# EAGLE design max10_bb (EAGLE 7.3.0)
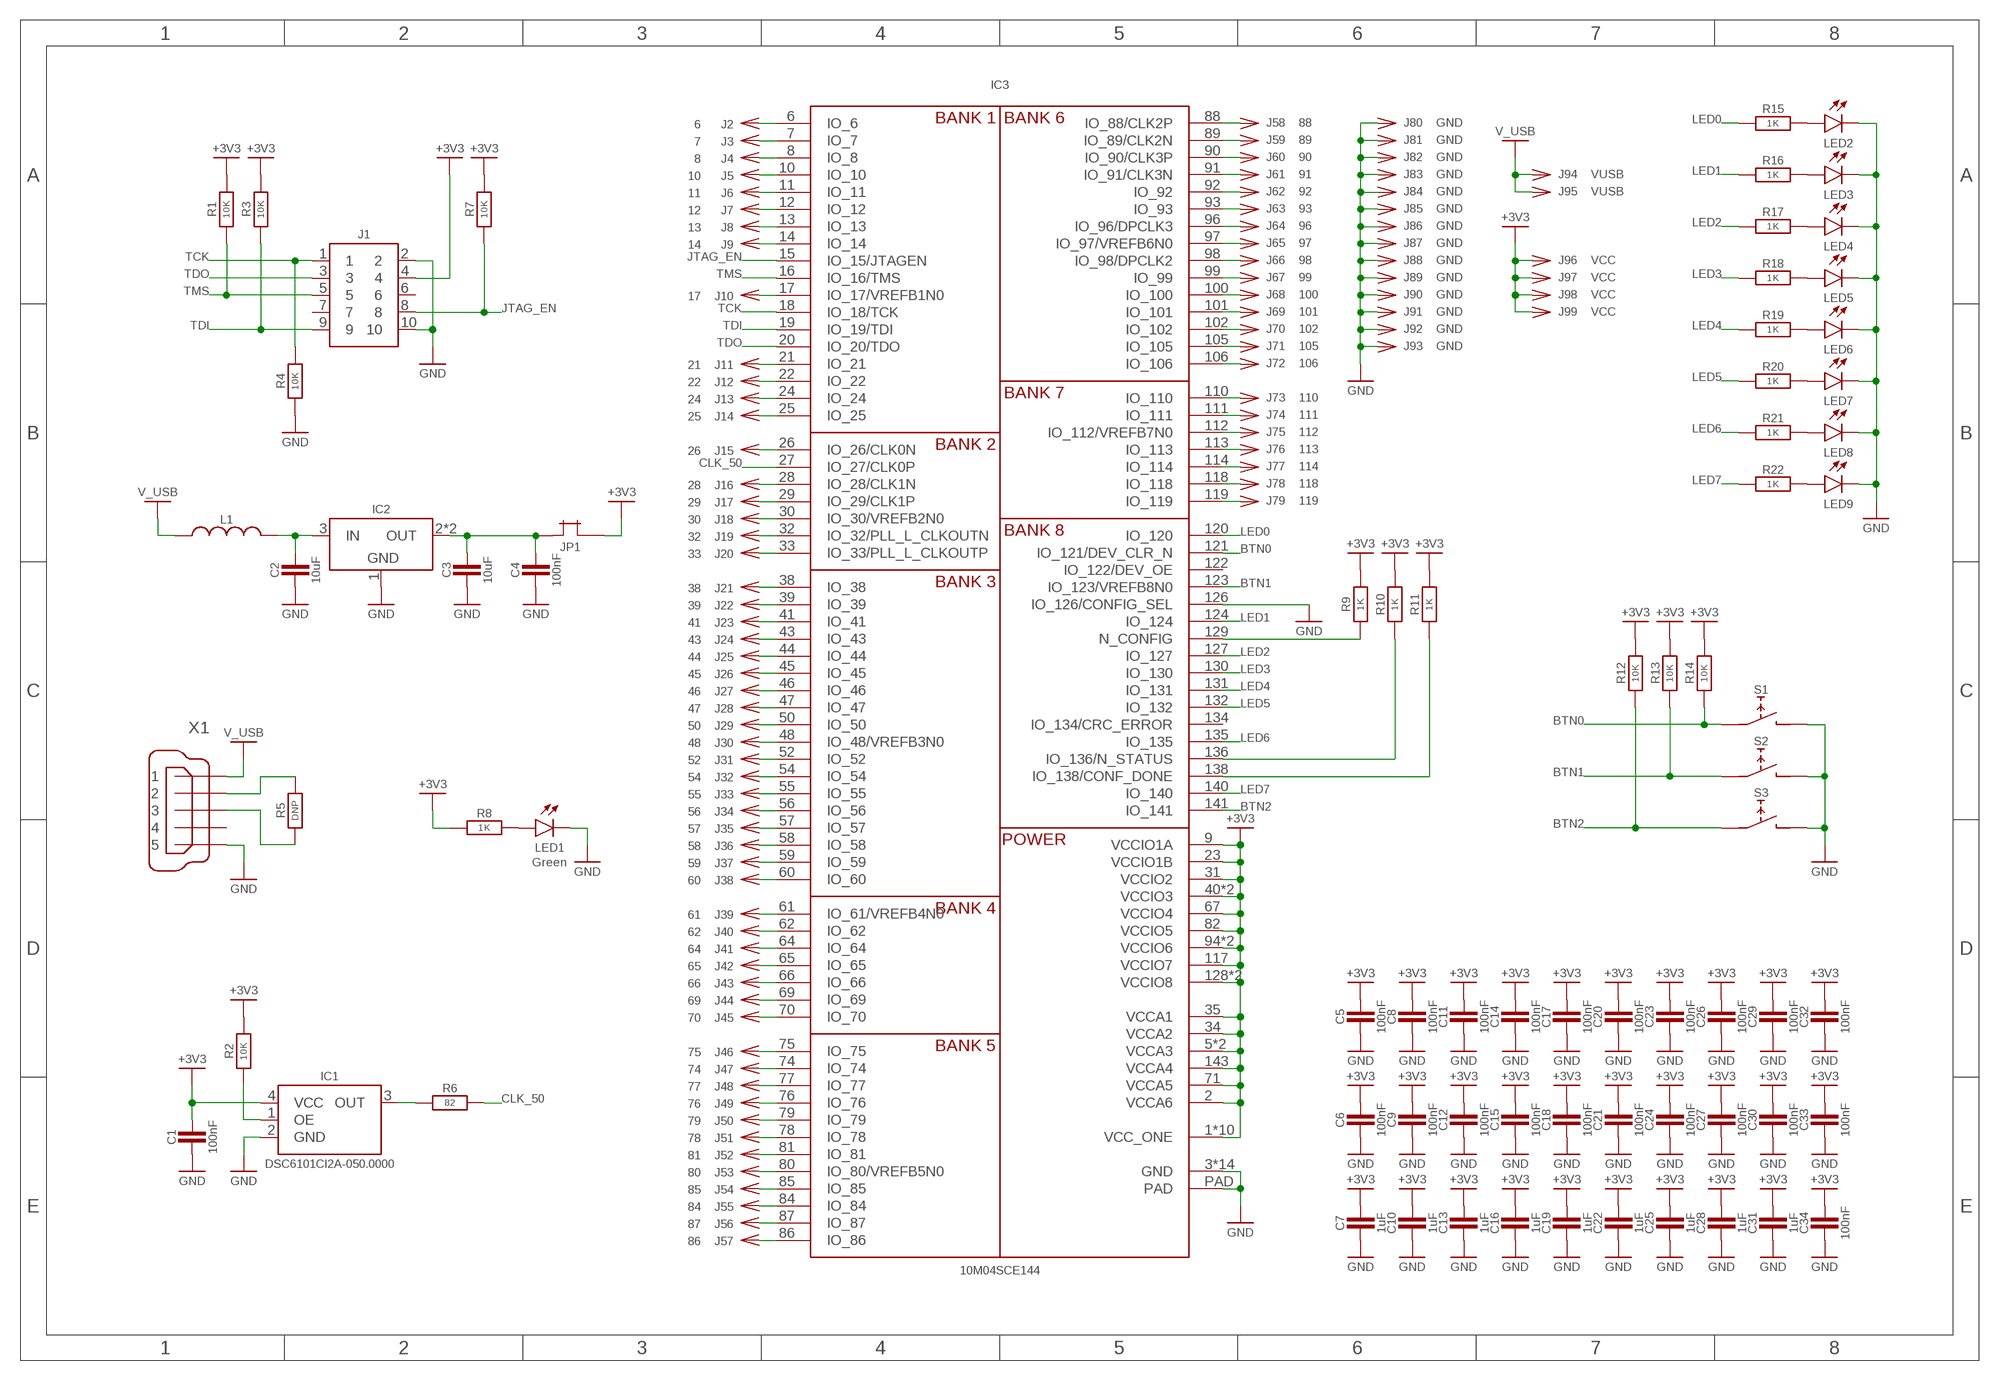
[diagram p0: schematic, sheet 1]

## Parts
C1  100nF  C-0603  [SMD0603]
C2  10uF  C-0805  [SMD0805]
C3  10uF  C-0805  [SMD0805]
C4  100nF  C-0603  [SMD0603]
C5  100nF  C-0603  [SMD0603]
C6  100nF  C-0603  [SMD0603]
C7  1uF  C-0603  [SMD0603]
C8  100nF  C-0603  [SMD0603]
C9  100nF  C-0603  [SMD0603]
C10  1uF  C-0603  [SMD0603]
C11  100nF  C-0603  [SMD0603]
C12  100nF  C-0603  [SMD0603]
C13  1uF  C-0603  [SMD0603]
C14  100nF  C-0603  [SMD0603]
C15  100nF  C-0603  [SMD0603]
C16  1uF  C-0603  [SMD0603]
C17  100nF  C-0603  [SMD0603]
C18  100nF  C-0603  [SMD0603]
C19  1uF  C-0603  [SMD0603]
C20  100nF  C-0603  [SMD0603]
C21  100nF  C-0603  [SMD0603]
C22  1uF  C-0603  [SMD0603]
C23  100nF  C-0603  [SMD0603]
C24  100nF  C-0603  [SMD0603]
C25  1uF  C-0603  [SMD0603]
C26  100nF  C-0603  [SMD0603]
C27  100nF  C-0603  [SMD0603]
C28  1uF  C-0603  [SMD0603]
C29  100nF  C-0603  [SMD0603]
C30  100nF  C-0603  [SMD0603]
C31  1uF  C-0603  [SMD0603]
C32  100nF  C-0603  [SMD0603]
C33  100nF  C-0603  [SMD0603]
C34  100nF  C-0603  [SMD0603]
IC1  DSC6101CI2A-050.0000  OSC_EN-CDFN4  [CDFN4]
IC2  LM1117-SOT223  [SOT223]
IC3  10M04SCE144  [EQFP-144-0.5MM]
J1  HEADER-5X2-TH-2.54  [HEADER-5X2-2.54MM]
J2  6  CONN-SINGLE-TH  [PIN-TH]
J3  7  CONN-SINGLE-TH  [PIN-TH]
J4  8  CONN-SINGLE-TH  [PIN-TH]
J5  10  CONN-SINGLE-TH  [PIN-TH]
J6  11  CONN-SINGLE-TH  [PIN-TH]
J7  12  CONN-SINGLE-TH  [PIN-TH]
J8  13  CONN-SINGLE-TH  [PIN-TH]
J9  14  CONN-SINGLE-TH  [PIN-TH]
J10  17  CONN-SINGLE-TH  [PIN-TH]
J11  21  CONN-SINGLE-TH  [PIN-TH]
J12  22  CONN-SINGLE-TH  [PIN-TH]
J13  24  CONN-SINGLE-TH  [PIN-TH]
J14  25  CONN-SINGLE-TH  [PIN-TH]
J15  26  CONN-SINGLE-TH  [PIN-TH]
J16  28  CONN-SINGLE-TH  [PIN-TH]
J17  29  CONN-SINGLE-TH  [PIN-TH]
J18  30  CONN-SINGLE-TH  [PIN-TH]
J19  32  CONN-SINGLE-TH  [PIN-TH]
J20  33  CONN-SINGLE-TH  [PIN-TH]
J21  38  CONN-SINGLE-TH  [PIN-TH]
J22  39  CONN-SINGLE-TH  [PIN-TH]
J23  41  CONN-SINGLE-TH  [PIN-TH]
J24  43  CONN-SINGLE-TH  [PIN-TH]
J25  44  CONN-SINGLE-TH  [PIN-TH]
J26  45  CONN-SINGLE-TH  [PIN-TH]
J27  46  CONN-SINGLE-TH  [PIN-TH]
J28  47  CONN-SINGLE-TH  [PIN-TH]
J29  50  CONN-SINGLE-TH  [PIN-TH]
J30  48  CONN-SINGLE-TH  [PIN-TH]
J31  52  CONN-SINGLE-TH  [PIN-TH]
J32  54  CONN-SINGLE-TH  [PIN-TH]
J33  55  CONN-SINGLE-TH  [PIN-TH]
J34  56  CONN-SINGLE-TH  [PIN-TH]
J35  57  CONN-SINGLE-TH  [PIN-TH]
J36  58  CONN-SINGLE-TH  [PIN-TH]
J37  59  CONN-SINGLE-TH  [PIN-TH]
J38  60  CONN-SINGLE-TH  [PIN-TH]
J39  61  CONN-SINGLE-TH  [PIN-TH]
J40  62  CONN-SINGLE-TH  [PIN-TH]
J41  64  CONN-SINGLE-TH  [PIN-TH]
J42  65  CONN-SINGLE-TH  [PIN-TH]
J43  66  CONN-SINGLE-TH  [PIN-TH]
J44  69  CONN-SINGLE-TH  [PIN-TH]
J45  70  CONN-SINGLE-TH  [PIN-TH]
J46  75  CONN-SINGLE-TH  [PIN-TH]
J47  74  CONN-SINGLE-TH  [PIN-TH]
J48  77  CONN-SINGLE-TH  [PIN-TH]
J49  76  CONN-SINGLE-TH  [PIN-TH]
J50  79  CONN-SINGLE-TH  [PIN-TH]
J51  78  CONN-SINGLE-TH  [PIN-TH]
J52  81  CONN-SINGLE-TH  [PIN-TH]
J53  80  CONN-SINGLE-TH  [PIN-TH]
J54  85  CONN-SINGLE-TH  [PIN-TH]
J55  84  CONN-SINGLE-TH  [PIN-TH]
J56  87  CONN-SINGLE-TH  [PIN-TH]
J57  86  CONN-SINGLE-TH  [PIN-TH]
J58  88  CONN-SINGLE-TH  [PIN-TH]
J59  89  CONN-SINGLE-TH  [PIN-TH]
J60  90  CONN-SINGLE-TH  [PIN-TH]
J61  91  CONN-SINGLE-TH  [PIN-TH]
J62  92  CONN-SINGLE-TH  [PIN-TH]
J63  93  CONN-SINGLE-TH  [PIN-TH]
J64  96  CONN-SINGLE-TH  [PIN-TH]
J65  97  CONN-SINGLE-TH  [PIN-TH]
J66  98  CONN-SINGLE-TH  [PIN-TH]
J67  99  CONN-SINGLE-TH  [PIN-TH]
J68  100  CONN-SINGLE-TH  [PIN-TH]
J69  101  CONN-SINGLE-TH  [PIN-TH]
J70  102  CONN-SINGLE-TH  [PIN-TH]
J71  105  CONN-SINGLE-TH  [PIN-TH]
J72  106  CONN-SINGLE-TH  [PIN-TH]
J73  110  CONN-SINGLE-TH  [PIN-TH]
J74  111  CONN-SINGLE-TH  [PIN-TH]
J75  112  CONN-SINGLE-TH  [PIN-TH]
J76  113  CONN-SINGLE-TH  [PIN-TH]
J77  114  CONN-SINGLE-TH  [PIN-TH]
J78  118  CONN-SINGLE-TH  [PIN-TH]
J79  119  CONN-SINGLE-TH  [PIN-TH]
J80  GND  CONN-SINGLE-TH  [PIN-TH]
J81  GND  CONN-SINGLE-TH  [PIN-TH]
J82  GND  CONN-SINGLE-TH  [PIN-TH]
J83  GND  CONN-SINGLE-TH  [PIN-TH]
J84  GND  CONN-SINGLE-TH  [PIN-TH]
J85  GND  CONN-SINGLE-TH  [PIN-TH]
J86  GND  CONN-SINGLE-TH  [PIN-TH]
J87  GND  CONN-SINGLE-TH  [PIN-TH]
J88  GND  CONN-SINGLE-TH  [PIN-TH]
J89  GND  CONN-SINGLE-TH  [PIN-TH]
J90  GND  CONN-SINGLE-TH  [PIN-TH]
J91  GND  CONN-SINGLE-TH  [PIN-TH]
J92  GND  CONN-SINGLE-TH  [PIN-TH]
J93  GND  CONN-SINGLE-TH  [PIN-TH]
J94  VUSB  CONN-SINGLE-TH  [PIN-TH]
J95  VUSB  CONN-SINGLE-TH  [PIN-TH]
J96  VCC  CONN-SINGLE-TH  [PIN-TH]
J97  VCC  CONN-SINGLE-TH  [PIN-TH]
J98  VCC  CONN-SINGLE-TH  [PIN-TH]
J99  VCC  CONN-SINGLE-TH  [PIN-TH]
JP1  JUMPER-TH-TH  [JUMPER-TH]
L1  L-0603  [SMD0603]
LED1  Green  LED_SMDLED_0603  [SMD0603]
LED2  LED_SMDLED_0603  [SMD0603]
LED3  LED_SMDLED_0603  [SMD0603]
LED4  LED_SMDLED_0603  [SMD0603]
LED5  LED_SMDLED_0603  [SMD0603]
LED6  LED_SMDLED_0603  [SMD0603]
LED7  LED_SMDLED_0603  [SMD0603]
LED8  LED_SMDLED_0603  [SMD0603]
LED9  LED_SMDLED_0603  [SMD0603]
R1  10K  R-0603  [SMD0603]
R2  10K  R-0603  [SMD0603]
R3  10K  R-0603  [SMD0603]
R4  10K  R-0603  [SMD0603]
R5  DNP  R-0603  [SMD0603]
R6  82  R-0603  [SMD0603]
R7  10K  R-0603  [SMD0603]
R8  1K  R-0603  [SMD0603]
R9  1K  R-0603  [SMD0603]
R10  1K  R-0603  [SMD0603]
R11  1K  R-0603  [SMD0603]
R12  10K  R-0603  [SMD0603]
R13  10K  R-0603  [SMD0603]
R14  10K  R-0603  [SMD0603]
R15  1K  R-0603  [SMD0603]
R16  1K  R-0603  [SMD0603]
R17  1K  R-0603  [SMD0603]
R18  1K  R-0603  [SMD0603]
R19  1K  R-0603  [SMD0603]
R20  1K  R-0603  [SMD0603]
R21  1K  R-0603  [SMD0603]
R22  1K  R-0603  [SMD0603]
S1  TACT_SWITCH_6MM-SMD  [TACT-SMD-6MM]
S2  TACT_SWITCH_6MM-SMD  [TACT-SMD-6MM]
S3  TACT_SWITCH_6MM-SMD  [TACT-SMD-6MM]
X1  MINI-USB-32005-201  [32005-201]

## Nets
+3V3: C1.2 C5.2 C6.2 C7.2 C8.2 C9.2 C10.2 C11.2 C12.2 C13.2 C14.2 C15.2 C16.2 C17.2 C18.2 C19.2 C20.2 C21.2 C22.2 C23.2 C24.2 C25.2 C26.2 C27.2 C28.2 C29.2 C30.2 C31.2 C32.2 C33.2 C34.2 IC1.4(VCC) IC3.1(VCC_ONE) IC3.2(VCCA6) IC3.5(VCCA3) IC3.9(VCCIO1A) IC3.23(VCCIO1B) IC3.31(VCCIO2) IC3.34(VCCA2) IC3.35(VCCA1) IC3.36(VCC_ONE) IC3.37(VCC_ONE) IC3.40(VCCIO3) IC3.49(VCCIO3) IC3.51(VCC_ONE) IC3.67(VCCIO4) IC3.71(VCCA5) IC3.72(VCC_ONE) IC3.73(VCC_ONE) IC3.82(VCCIO5) IC3.94(VCCIO6) IC3.103(VCCIO6) IC3.107(VCCA3) IC3.108(VCC_ONE) IC3.109(VCC_ONE) IC3.115(VCC_ONE) IC3.117(VCCIO7) IC3.128(VCCIO8) IC3.139(VCCIO8) IC3.143(VCCA4) IC3.144(VCC_ONE) J1.4 J96.1 J97.1 J98.1 J99.1 JP1.2 R1.2 R2.2 R3.2 R7.2 R8.1 R9.2 R10.2 R11.2 R12.2 R13.2 R14.2
BTN0: IC3.121(IO_121/DEV_CLR_N) R14.1 S1.1 S1.2
BTN1: IC3.123(IO_123/VREFB8N0) R13.1 S2.1 S2.2
BTN2: IC3.141(IO_141) R12.1 S3.1 S3.2
CLK_50: IC3.27(IO_27/CLK0P) R6.2
GND: C1.1 C2.1 C3.1 C4.1 C5.1 C6.1 C7.1 C8.1 C9.1 C10.1 C11.1 C12.1 C13.1 C14.1 C15.1 C16.1 C17.1 C18.1 C19.1 C20.1 C21.1 C22.1 C23.1 C24.1 C25.1 C26.1 C27.1 C28.1 C29.1 C30.1 C31.1 C32.1 C33.1 C34.1 IC1.2(GND) IC2.1(GND) IC3.3(GND) IC3.4(GND) IC3.42(GND) IC3.53(GND) IC3.63(GND) IC3.68(GND) IC3.83(GND) IC3.95(GND) IC3.104(GND) IC3.116(GND) IC3.125(GND) IC3.126(IO_126/CONFIG_SEL) IC3.133(GND) IC3.137(GND) IC3.142(GND) IC3.PAD J1.2 J1.10 J80.1 J81.1 J82.1 J83.1 J84.1 J85.1 J86.1 J87.1 J88.1 J89.1 J90.1 J91.1 J92.1 J93.1 LED1.2(C) LED2.2(C) LED3.2(C) LED4.2(C) LED5.2(C) LED6.2(C) LED7.2(C) LED8.2(C) LED9.2(C) R4.1 S1.3 S1.4 S2.3 S2.4 S3.3 S3.4 X1.5
IN: C2.2 IC2.3(IN) L1.2
JTAG_EN: IC3.15(IO_15/JTAGEN) J1.8 R7.1
LED0: IC3.120(IO_120) R15.1
LED1: IC3.124(IO_124) R16.1
LED2: IC3.127(IO_127) R17.1
LED3: IC3.130(IO_130) R18.1
LED4: IC3.131(IO_131) R19.1
LED5: IC3.132(IO_132) R20.1
LED6: IC3.135(IO_135) R21.1
LED7: IC3.140(IO_140) R22.1
N$1: IC3.6(IO_6) J2.1
N$2: IC3.7(IO_7) J3.1
N$3: IC3.8(IO_8) J4.1
N$4: IC3.10(IO_10) J5.1
N$5: IC3.11(IO_11) J6.1
N$6: IC3.12(IO_12) J7.1
N$7: IC3.14(IO_14) J9.1
N$8: IC3.17(IO_17/VREFB1N0) J10.1
N$9: IC3.21(IO_21) J11.1
N$10: IC3.22(IO_22) J12.1
N$11: IC3.24(IO_24) J13.1
N$12: IC3.25(IO_25) J14.1
N$13: IC3.13(IO_13) J8.1
N$14: IC3.110(IO_110) J73.1
N$15: IC3.111(IO_111) J74.1
N$16: IC3.112(IO_112/VREFB7N0) J75.1
N$17: IC3.113(IO_113) J76.1
N$18: IC3.114(IO_114) J77.1
N$19: IC3.118(IO_118) J78.1
N$20: IC3.119(IO_119) J79.1
N$21: IC3.88(IO_88/CLK2P) J58.1
N$22: IC3.89(IO_89/CLK2N) J59.1
N$23: IC3.90(IO_90/CLK3P) J60.1
N$24: IC3.91(IO_91/CLK3N) J61.1
N$25: IC3.92(IO_92) J62.1
N$26: IC3.93(IO_93) J63.1
N$27: IC3.96(IO_96/DPCLK3) J64.1
N$28: IC3.97(IO_97/VREFB6N0) J65.1
N$29: IC3.98(IO_98/DPCLK2) J66.1
N$30: IC3.99(IO_99) J67.1
N$31: IC3.100(IO_100) J68.1
N$32: IC3.101(IO_101) J69.1
N$33: IC3.102(IO_102) J70.1
N$34: IC3.105(IO_105) J71.1
N$35: IC3.106(IO_106) J72.1
N$46: IC3.26(IO_26/CLK0N) J15.1
N$48: IC3.28(IO_28/CLK1N) J16.1
N$49: IC3.29(IO_29/CLK1P) J17.1
N$50: IC3.30(IO_30/VREFB2N0) J18.1
N$51: IC3.32(IO_32/PLL_L_CLKOUTN) J19.1
N$52: IC3.33(IO_33/PLL_L_CLKOUTP) J20.1
N$53: IC3.38(IO_38) J21.1
N$54: IC3.39(IO_39) J22.1
N$55: IC3.41(IO_41) J23.1
N$56: IC3.44(IO_44) J25.1
N$57: IC3.45(IO_45) J26.1
N$58: IC3.46(IO_46) J27.1
N$59: IC3.47(IO_47) J28.1
N$60: IC3.50(IO_50) J29.1
N$61: IC3.48(IO_48/VREFB3N0) J30.1
N$62: IC3.52(IO_52) J31.1
N$63: IC3.54(IO_54) J32.1
N$64: IC3.55(IO_55) J33.1
N$65: IC3.56(IO_56) J34.1
N$66: IC3.57(IO_57) J35.1
N$67: IC3.58(IO_58) J36.1
N$68: IC3.59(IO_59) J37.1
N$69: IC3.60(IO_60) J38.1
N$70: IC3.61(IO_61/VREFB4N0) J39.1
N$71: IC3.62(IO_62) J40.1
N$72: IC3.64(IO_64) J41.1
N$73: IC3.65(IO_65) J42.1
N$74: IC3.66(IO_66) J43.1
N$75: IC3.69(IO_69) J44.1
N$76: IC3.70(IO_70) J45.1
N$77: IC3.75(IO_75) J46.1
N$78: IC3.74(IO_74) J47.1
N$79: IC3.76(IO_76) J49.1
N$80: IC3.79(IO_79) J50.1
N$81: IC3.81(IO_81) J52.1
N$82: IC3.80(IO_80/VREFB5N0) J53.1
N$83: IC3.84(IO_84) J55.1
N$84: IC3.87(IO_87) J56.1
N$85: IC3.86(IO_86) J57.1
N$86: IC3.85(IO_85) J54.1
N$87: IC3.78(IO_78) J51.1
N$88: IC3.77(IO_77) J48.1
N$89: IC3.43(IO_43) J24.1
N$90: IC1.3(OUT) R6.1
N$91: R5.2 X1.2
N$92: R5.1 X1.3
N$93: IC1.1(OE) R2.1
N$94: LED1.1(A) R8.2
N$97: IC3.129(N_CONFIG) R9.1
N$99: IC3.136(IO_136/N_STATUS) R10.1
N$100: IC3.138(IO_138/CONF_DONE) R11.1
N$101: LED6.1(A) R19.2
N$102: LED7.1(A) R20.2
N$103: LED8.1(A) R21.2
N$104: LED9.1(A) R22.2
N$105: LED2.1(A) R15.2
N$106: LED3.1(A) R16.2
N$107: LED4.1(A) R17.2
N$108: LED5.1(A) R18.2
OUT: C3.2 C4.2 IC2.2(OUT) IC2.4(OUT) JP1.1
TCK: IC3.18(IO_18/TCK) J1.1 R4.2
TDI: IC3.19(IO_19/TDI) J1.9 R3.1
TDO: IC3.20(IO_20/TDO) J1.3
TMS: IC3.16(IO_16/TMS) J1.5 R1.1
V_USB: J94.1 J95.1 L1.1 X1.1
Unconnected: IC3.122(IO_122/DEV_OE) IC3.134(IO_134/CRC_ERROR) J1.6 J1.7 X1.4

## Library data of the parts
C1-C34 = ataradov_rlc:C
IC1 = ataradov_crystal:OSC_EN: Generic oscillator with output enable
IC2 = ataradov_vreg:LM1117: LM1117 voltage regulator
IC3 = ataradov_pld:10M04SCE144
J1 = ataradov_conn:HEADER-5X2
J2-J99 = ataradov_conn:CONN-SINGLE
JP1 = ataradov_conn:JUMPER-TH
L1 = ataradov_rlc:L
LED1-LED9 = ataradov_led:LED_SMD: SMD_LED
R1-R22 = ataradov_rlc:R
S1-S3 = ataradov_switch:TACT_SWITCH_6MM
X1 = con-cypressindustries:MINI-USB-: MINI USB-B Conector Source: www.cypressindustries.com; OC_FARNELL: unknown; OC_NEWARK: unknown

## Board
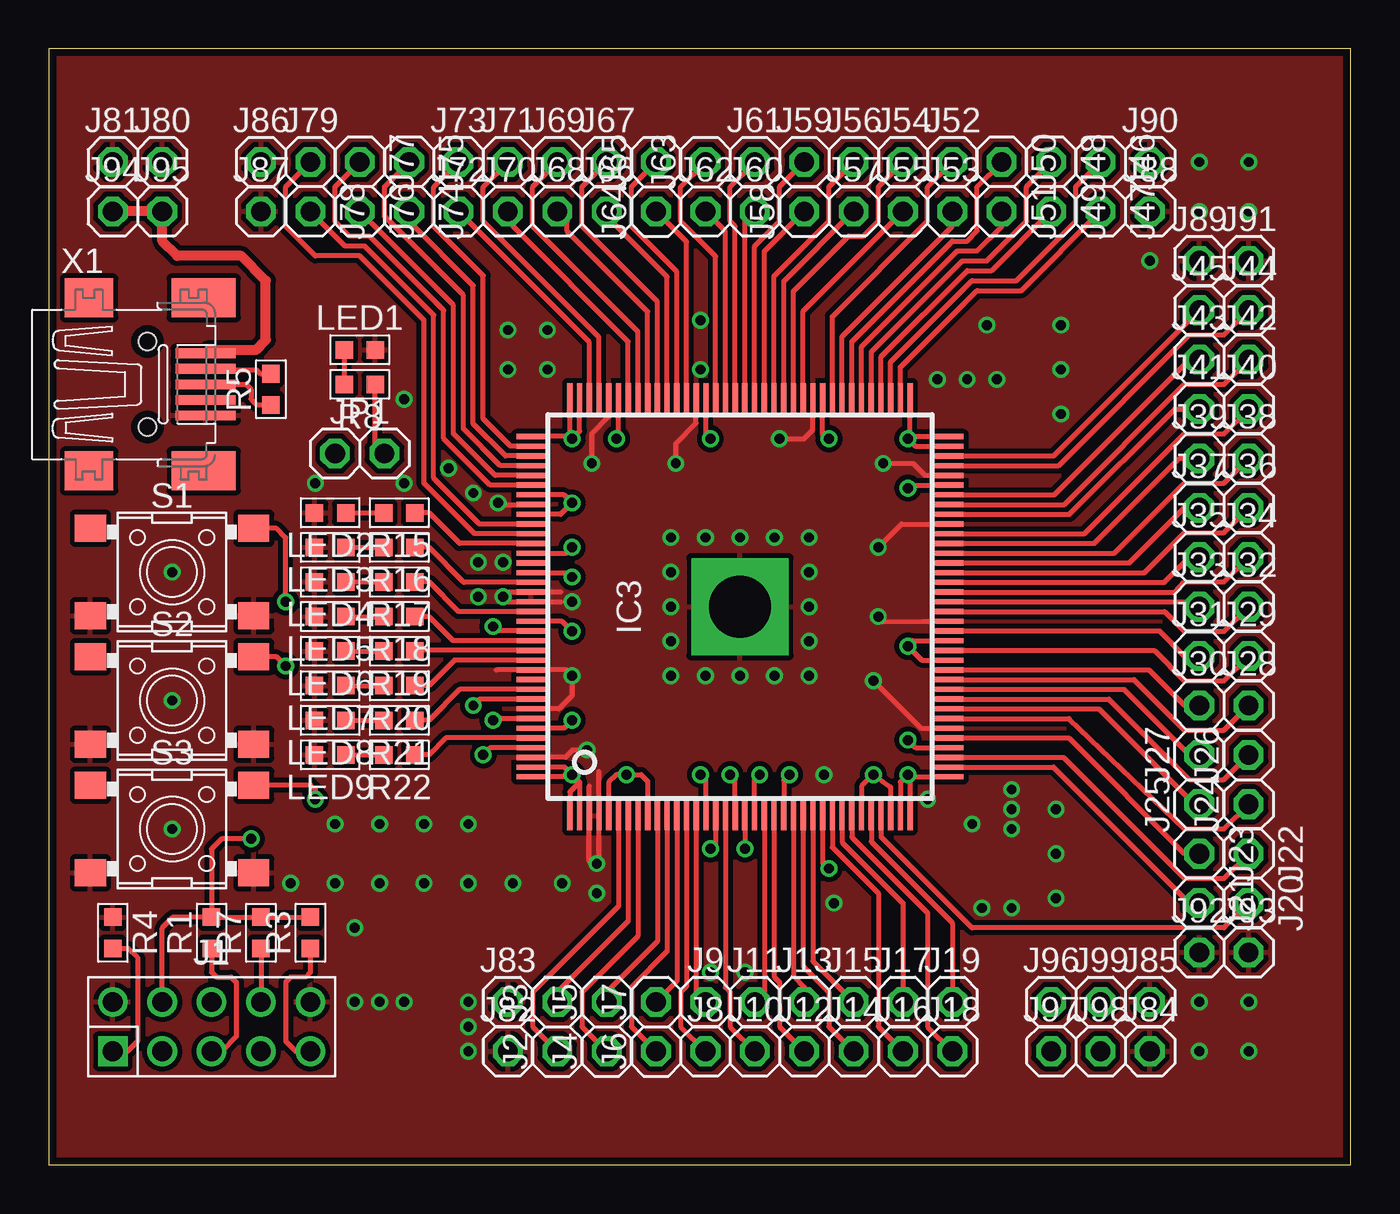
[diagram p1: board, top side]
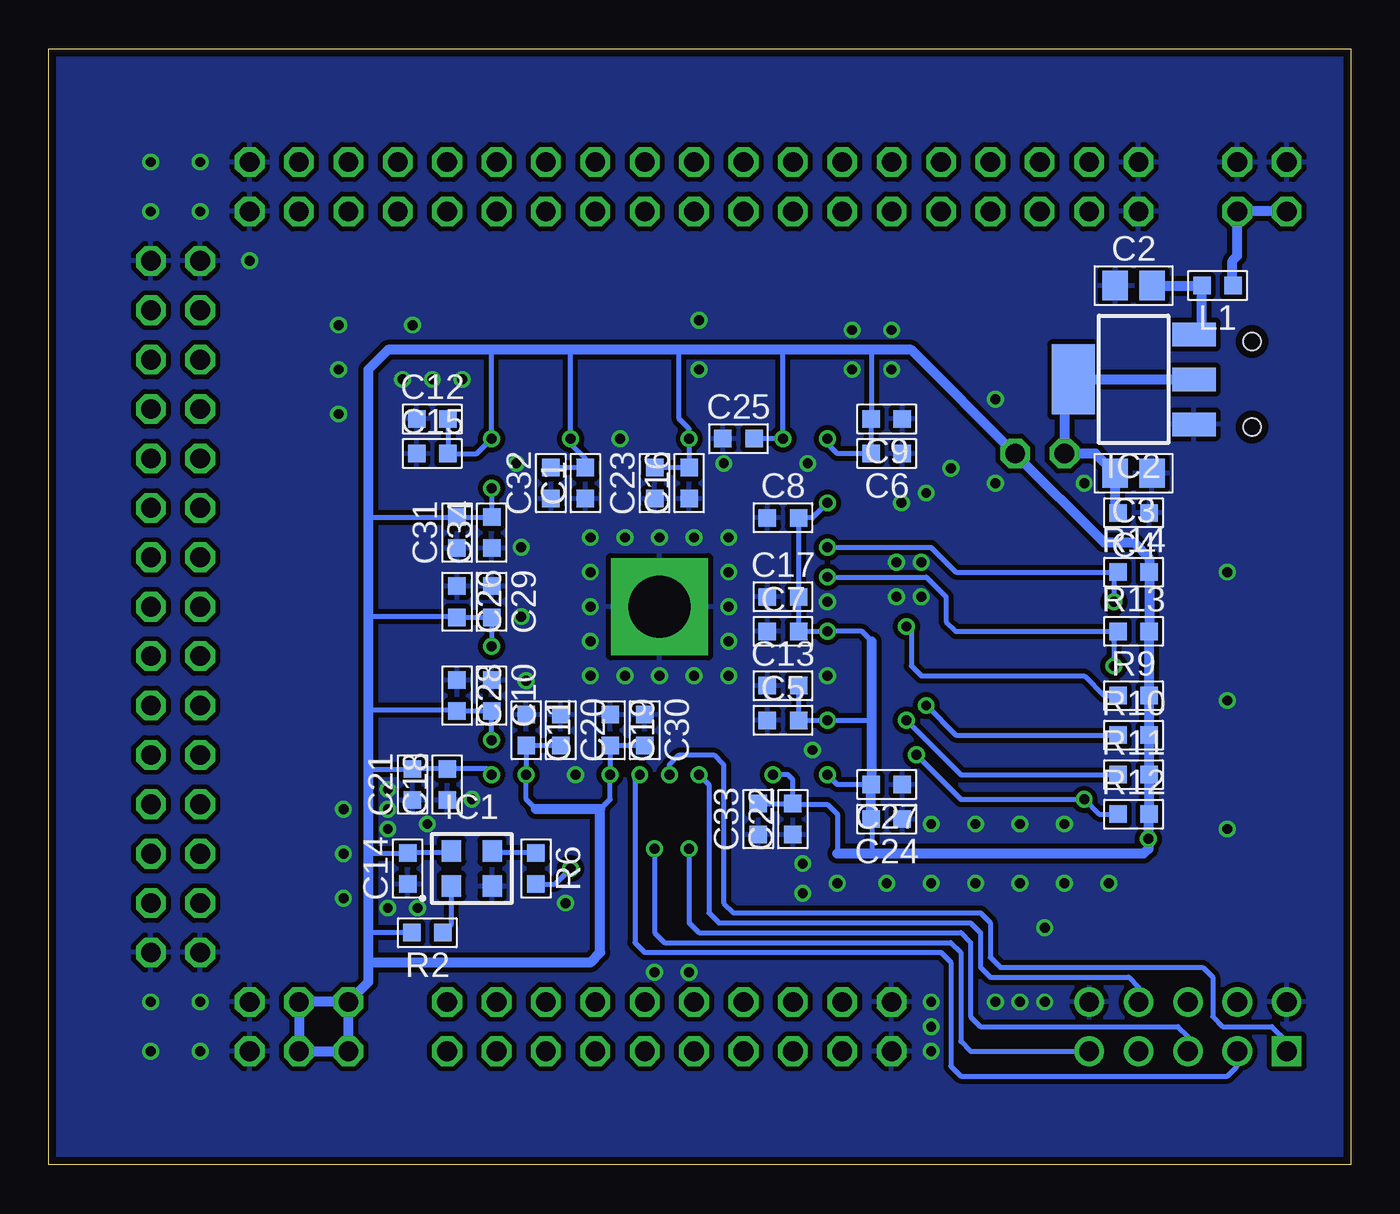
[diagram p2: board, bottom side, seen from below]

Size 66.98 x 57.39 mm. Coordinates in mm from the lower left corner, seen from the top.
Outline: 0,0 66.98,0 66.98,57.39 0,57.39 0,0
Copper layers (1*16): Top 0.0356mm / dielectric 1.5011mm / Bottom 0.0356mm
Design rules "OSHPark": minimum track width 6mil, minimum drill 13mil, track to track 6mil, track to pad 6mil, pad to pad 6mil, via to via 6mil, smd to smd 6mil, copper to edge 15mil, drill to drill 6mil, minimum pad ring 7mil, minimum via ring 7mil, stop-mask expansion 3mil, vias tented up to drill 0mil, thermal gap 10mil

### Footprints (pad centres in the part's own frame; a part is rotated, then mirrored left to right if it is on the bottom)
SMD0603 = smd 0.9 x 0.9: 1 -0.8,0; 2 0.8,0
SMD0805 = smd 1.3 x 1.5: 1 -0.95,0; 2 0.95,0
CDFN4 = smd 1 x 1.1: 1 -1.05,-0.9; 2 1.05,-0.9; 3 1.05,0.9; 4 -1.05,0.9
SOT223 = smd 1.219 x 2.235: 1 -2.311,-3.099; 2 0,-3.099; 3 2.311,-3.099 | smd 3.6 x 2.2: 4 0,3.099
EQFP-144-0.5MM = smd 1.5 x 0.27: 1 -10.75,8.75; 2 -10.75,8.25; 3 -10.75,7.75; 4 -10.75,7.25; 5 -10.75,6.75; 6 -10.75,6.25; 7 -10.75,5.75; 8 -10.75,5.25; 9 -10.75,4.75; 10 -10.75,4.25; 11 -10.75,3.75; 12 -10.75,3.25; 13 -10.75,2.75; 14 -10.75,2.25; 15 -10.75,1.75; 16 -10.75,1.25; 17 -10.75,0.75; 18 -10.75,0.25; 19 -10.75,-0.25; 20 -10.75,-0.75; 21 -10.75,-1.25; 22 -10.75,-1.75; 23 -10.75,-2.25; 24 -10.75,-2.75; 25 -10.75,-3.25; 26 -10.75,-3.75; 27 -10.75,-4.25; 28 -10.75,-4.75; 29 -10.75,-5.25; 30 -10.75,-5.75; 31 -10.75,-6.25; 32 -10.75,-6.75; 33 -10.75,-7.25; 34 -10.75,-7.75; 35 -10.75,-8.25; 36 -10.75,-8.75; 73 10.75,-8.75; 74 10.75,-8.25; 75 10.75,-7.75; 76 10.75,-7.25; 77 10.75,-6.75; 78 10.75,-6.25; 79 10.75,-5.75; 80 10.75,-5.25; 81 10.75,-4.75; 82 10.75,-4.25; 83 10.75,-3.75; 84 10.75,-3.25; 85 10.75,-2.75; 86 10.75,-2.25; 87 10.75,-1.75; 88 10.75,-1.25; 89 10.75,-0.75; 90 10.75,-0.25; 91 10.75,0.25; 92 10.75,0.75; 93 10.75,1.25; 94 10.75,1.75; 95 10.75,2.25; 96 10.75,2.75; 97 10.75,3.25; 98 10.75,3.75; 99 10.75,4.25; 100 10.75,4.75; 101 10.75,5.25; 102 10.75,5.75; 103 10.75,6.25; 104 10.75,6.75; 105 10.75,7.25; 106 10.75,7.75; 107 10.75,8.25; 108 10.75,8.75 | smd 0.27 x 1.5: 37 -8.75,-10.75; 38 -8.25,-10.75; 39 -7.75,-10.75; 40 -7.25,-10.75; 41 -6.75,-10.75; 42 -6.25,-10.75; 43 -5.75,-10.75; 44 -5.25,-10.75; 45 -4.75,-10.75; 46 -4.25,-10.75; 47 -3.75,-10.75; 48 -3.25,-10.75; 49 -2.75,-10.75; 50 -2.25,-10.75; 51 -1.75,-10.75; 52 -1.25,-10.75; 53 -0.75,-10.75; 54 -0.25,-10.75; 55 0.25,-10.75; 56 0.75,-10.75; 57 1.25,-10.75; 58 1.75,-10.75; 59 2.25,-10.75; 60 2.75,-10.75; 61 3.25,-10.75; 62 3.75,-10.75; 63 4.25,-10.75; 64 4.75,-10.75; 65 5.25,-10.75; 66 5.75,-10.75; 67 6.25,-10.75; 68 6.75,-10.75; 69 7.25,-10.75; 70 7.75,-10.75; 71 8.25,-10.75; 72 8.75,-10.75; 109 8.75,10.75; 110 8.25,10.75; 111 7.75,10.75; 112 7.25,10.75; 113 6.75,10.75; 114 6.25,10.75; 115 5.75,10.75; 116 5.25,10.75; 117 4.75,10.75; 118 4.25,10.75; 119 3.75,10.75; 120 3.25,10.75; 121 2.75,10.75; 122 2.25,10.75; 123 1.75,10.75; 124 1.25,10.75; 125 0.75,10.75; 126 0.25,10.75; 127 -0.25,10.75; 128 -0.75,10.75; 129 -1.25,10.75; 130 -1.75,10.75; 131 -2.25,10.75; 132 -2.75,10.75; 133 -3.25,10.75; 134 -3.75,10.75; 135 -4.25,10.75; 136 -4.75,10.75; 137 -5.25,10.75; 138 -5.75,10.75; 139 -6.25,10.75; 140 -6.75,10.75; 141 -7.25,10.75; 142 -7.75,10.75; 143 -8.25,10.75; 144 -8.75,10.75 | drill 3.2 pad 5 square: PAD 0,0
HEADER-5X2-2.54MM = drill 1.016 square: 1 -5.08,-1.27 | drill 1.016: 2 -5.08,1.27; 3 -2.54,-1.27; 4 -2.54,1.27; 5 0,-1.27; 6 0,1.27; 7 2.54,-1.27; 8 2.54,1.27; 9 5.08,-1.27; 10 5.08,1.27
PIN-TH = drill 1.016 octagon: 1 0,0
JUMPER-TH = drill 1.016 octagon: 1 -1.27,0; 2 1.27,0
TACT-SMD-6MM = smd 1.6 x 1.4: 1 -4.2,2.25; 2 4.2,2.25; 3 -4.2,-2.25; 4 4.2,-2.25
32005-201 = smd 3.1 x 0.5: 1 3,1.6; 2 3,0.8; 3 3,0; 4 3,-0.8; 5 3,-1.6 | smd 2.5 x 2: M1 -3,-4.45; M2 -3,4.45 | smd 3.3 x 2: M3 2.9,4.45; M4 2.9,-4.45 | hole 0.9: 0,2.2; 0,-2.2

### Placement (x,y rotation side)
C1  39.37,35.05 90 bottom
C2  11.18,45.21 0 bottom
C3  11.18,35.56 180 bottom
C4  11.18,33.53 180 bottom
C5  29.21,22.86 0 bottom
C6  23.88,36.58 180 bottom
C7  29.21,27.43 0 bottom
C8  29.21,33.27 0 bottom
C9  23.88,38.35 180 bottom
C10  44.2,24.13 270 bottom
C11  42.42,22.35 270 bottom
C12  47.24,38.35 0 bottom
C13  29.21,24.64 0 bottom
C14  48.51,15.24 90 bottom
C15  47.24,36.58 0 bottom
C16  34.04,35.05 90 bottom
C17  29.21,29.21 0 bottom
C18  46.48,19.56 90 bottom
C19  38.1,22.35 270 bottom
C20  40.64,22.35 270 bottom
C21  48.26,19.56 90 bottom
C22  28.7,17.78 90 bottom
C23  35.81,35.05 90 bottom
C24  23.88,17.78 180 bottom
C25  31.5,37.34 0 bottom
C26  45.97,28.96 270 bottom
C27  23.88,19.56 180 bottom
C28  45.97,24.13 270 bottom
C29  44.2,28.96 270 bottom
C30  36.32,22.35 270 bottom
C31  45.97,32.51 90 bottom
C32  41.15,35.05 90 bottom
C33  30.48,17.78 90 bottom
C34  44.2,32.51 90 bottom
IC1  45.21,15.24 0 bottom
IC2  11.18,40.39 90 bottom
IC3  35.56,28.7 90 top
J1  8.38,7.11 0 top
J2  26.16,5.84 90 top
J3  26.16,8.38 90 top
J4  28.7,5.84 90 top
J5  28.7,8.38 90 top
J6  31.24,5.84 90 top
J7  31.24,8.38 90 top
J8  33.78,5.84 0 top
J9  33.78,8.38 0 top
J10  36.32,5.84 0 top
J11  36.32,8.38 0 top
J12  38.86,5.84 0 top
J13  38.86,8.38 0 top
J14  41.4,5.84 0 top
J15  41.4,8.38 0 top
J16  43.94,5.84 0 top
J17  43.94,8.38 0 top
J18  46.48,5.84 0 top
J19  46.48,8.38 0 top
J20  61.72,13.46 270 top
J21  59.18,13.46 270 top
J22  61.72,16 270 top
J23  59.18,16 270 top
J24  61.72,18.54 90 top
J25  59.18,18.54 90 top
J26  61.72,21.08 90 top
J27  59.18,21.08 90 top
J28  61.72,23.62 0 top
J29  61.72,26.16 0 top
J30  59.18,23.62 0 top
J31  59.18,26.16 0 top
J32  61.72,28.7 0 top
J33  59.18,28.7 0 top
J34  61.72,31.24 0 top
J35  59.18,31.24 0 top
J36  61.72,33.78 0 top
J37  59.18,33.78 0 top
J38  61.72,36.32 0 top
J39  59.18,36.32 0 top
J40  61.72,38.86 0 top
J41  59.18,38.86 0 top
J42  61.72,41.4 0 top
J43  59.18,41.4 0 top
J44  61.72,43.94 0 top
J45  59.18,43.94 0 top
J46  54.1,51.56 270 top
J47  54.1,49.02 270 top
J48  51.56,51.56 270 top
J49  51.56,49.02 270 top
J50  49.02,51.56 270 top
J51  49.02,49.02 270 top
J52  46.48,51.56 0 top
J53  46.48,49.02 0 top
J54  43.94,51.56 0 top
J55  43.94,49.02 0 top
J56  41.4,51.56 0 top
J57  41.4,49.02 0 top
J58  38.86,49.02 90 top
J59  38.86,51.56 0 top
J60  36.32,49.02 0 top
J61  36.32,51.56 0 top
J62  33.78,49.02 0 top
J63  33.78,51.56 90 top
J64  31.24,49.02 90 top
J65  31.24,51.56 90 top
J66  28.7,49.02 0 top
J67  28.7,51.56 0 top
J68  26.16,49.02 0 top
J69  26.16,51.56 0 top
J70  23.62,49.02 0 top
J71  23.62,51.56 0 top
J72  21.08,49.02 0 top
J73  21.08,51.56 0 top
J74  18.54,49.02 270 top
J75  18.54,51.56 270 top
J76  16,49.02 270 top
J77  16,51.56 270 top
J78  13.46,49.02 270 top
J79  13.46,51.56 0 top
J80  5.84,51.56 0 top
J81  3.3,51.56 0 top
J82  23.62,5.84 0 top
J83  23.62,8.38 0 top
J84  56.64,5.84 0 top
J85  56.64,8.38 0 top
J86  10.92,51.56 0 top
J87  10.92,49.02 0 top
J88  56.64,49.02 0 top
J89  59.18,46.48 0 top
J90  56.64,51.56 0 top
J91  61.72,46.48 0 top
J92  59.18,10.92 0 top
J93  61.72,10.92 0 top
J94  3.3,49.02 0 top
J95  5.84,49.02 0 top
J96  51.56,8.38 0 top
J97  51.56,5.84 0 top
J98  54.1,5.84 0 top
J99  54.1,8.38 0 top
JP1  16,36.58 0 top
L1  6.86,45.21 180 bottom
LED1  16,41.91 0 top
LED2  14.48,33.53 180 top
LED3  14.48,31.75 180 top
LED4  14.48,29.97 180 top
LED5  14.48,28.19 180 top
LED6  14.48,26.42 180 top
LED7  14.48,24.64 180 top
LED8  14.48,22.86 180 top
LED9  14.48,21.08 180 top
R1  8.38,11.94 90 top
R2  47.5,11.94 180 bottom
R3  13.46,11.94 90 top
R4  3.3,11.94 270 top
R5  11.43,39.88 90 top
R6  41.91,15.24 270 bottom
R7  10.92,11.94 90 top
R8  16,40.13 180 top
R9  11.18,24.13 0 bottom
R10  11.18,22.1 0 bottom
R11  11.18,20.07 0 bottom
R12  11.18,18.03 0 bottom
R13  11.18,27.43 0 bottom
R14  11.18,30.48 0 bottom
R15  18.03,33.53 180 top
R16  18.03,31.75 180 top
R17  18.03,29.97 180 top
R18  18.03,28.19 180 top
R19  18.03,26.42 180 top
R20  18.03,24.64 180 top
R21  18.03,22.86 180 top
R22  18.03,21.08 180 top
S1  6.35,30.48 0 top
S2  6.35,23.88 0 top
S3  6.35,17.27 0 top
X1  5.08,40.13 0 top

### Tracks (layer width: path | path; a pad name or v marks a point on that pad's centre or on a via)
+3V3  (via drill 0.51)
  Top 0.254: R1.2 R7.2 R3.2 | J1.4 5.84,12.19 6.39,12.74 R1.2 | v44.2,34.8 44.35,34.95 IC3.67 | IC3.51 44.42,26.95 v44.2,26.67 44.91,25.95 IC3.49 | v40.13,37.34 39.81,37.52 IC3.82 | v34.04,37.34 33.81,37.56 IC3.94 | v29.21,37.34 29.31,37.44 IC3.103 | v26.92,27.43 26.4,27.95 IC3.128 | v26.92,22.86 26.52,22.45 IC3.139 | IC3.9 30.81,19.74 30.48,20.07 v29.72,20.07 29.21,20.07 28.81,19.67 IC3.5 | v38.1,20.07 37.81,19.78 IC3.23 | v26.92,20.07 26.54,20.45 IC3.143 | v26.92,20.07 26.81,19.95 IC3.144 | v26.92,20.07 27.31,19.68 | 27.31,19.68 IC3.2 | 27.31,19.68 26.81,19.18 IC3.1 | IC3.107 27.31,37.72 v26.92,37.34 26.81,37.45 | 26.81,37.45 IC3.108 | 26.81,37.45 IC3.109 | 44.31,37.45 IC3.73 | 44.31,37.45 v44.2,37.34 44.58,36.95 IC3.71 | 44.31,37.45 IC3.72 | 44.31,19.95 IC3.37 | 44.31,19.95 v44.2,20.07 43.81,19.68 IC3.35 | 44.31,19.95 IC3.36 | IC3.34 43.31,19.43 v42.42,20.07 41.81,19.46 IC3.31 | v44.2,21.84 44.59,21.45 IC3.40 | IC3.115 26.51,34.45 v26.92,34.04 26.34,33.45 IC3.117 | v10.41,16.76 8.89,16.76 8.38,16.26 R1.2 | JP1.2 16.8,37.05 R8.1
  Bottom 0.254: R12.2 10.41,18 | C25.2 v29.21,37.34 29.21,41.91 | C23.2 C16.2 v34.04,37.34 34.04,37.85 34.54,38.35 34.54,41.91 | 40.13,41.91 v40.13,37.34 40.13,37.08 39.37,36.32 C1.2 C32.2 | C12.2 C15.2 44.96,36.58 v44.2,37.34 44.2,41.91 | v26.92,37.34 26.92,37.08 26.42,36.58 C6.2 C9.2 24.64,38.35 24.64,41.91 | v44.2,34.8 C34.2 C31.2 | v44.2,26.67 C29.2 C26.2 45.97,28.19 50.55,28.19 | v44.2,21.84 C10.2 C28.2 46.01,23.37 50.55,23.37 | v44.2,20.07 44.41,20.36 C18.2 C21.2 48.3,20.32 50.55,20.32 | C30.2 C19.2 v38.1,20.07 38.1,18.8 38.61,18.29 | C20.2 C11.2 v42.42,20.07 42.42,18.8 41.91,18.29 | v26.92,34.04 27.69,33.27 C8.2 C17.2 C7.2 v26.92,27.43 25.15,27.43 24.64,26.92 | C13.2 C5.2 v26.92,22.86 24.64,22.86 | 24.64,16 24.64,17.78 C24.2 | v26.92,20.07 26.42,19.56 C27.2 24.64,19.6 | C33.2 C22.2 | 26.42,16 26.42,18.03 26.92,18.54 28.66,18.54 C22.2 | C22.2 28.7,19.81 28.96,20.07 v29.72,20.07 | C31.2 46.01,33.27 | 50.55,33.27 50.51,33.31 C31.2 | IC1.4 46.36,16.04 C14.2 48.55,16 50.55,16 | R2.2 50.55,11.94
  Bottom 0.508: R12.2 R11.2 R10.2 R9.2 R13.2 R14.2 10.38,31.2 11.18,32 12.7,32 JP1.2 22.61,41.91 24.64,41.91 29.21,41.91 34.54,41.91 40.13,41.91 44.2,41.91 49.53,41.91 50.55,40.89 50.55,33.27 50.55,28.19 50.55,23.37 50.55,20.32 50.55,16 50.55,11.94 50.55,10.41 | 10.41,18 v10.41,16.76 10.41,16.26 10.67,16 24.64,16 26.42,16 | 50.55,10.41 50.55,9.4 J96.1 | C24.2 C27.2 | 24.64,19.6 24.64,22.86 24.64,26.92 | J96.1 J99.1 J98.1 J97.1 J96.1 | 50.55,10.41 39.12,10.41 38.61,10.92 38.61,18.29 41.91,18.29
BTN0  (via drill 0.51)
  Top 0.254: IC3.121 26.63,31.45 v26.92,31.75 | v12.19,28.96 12.19,32.26 11.72,32.73 S1.2
  Bottom 0.254: v26.92,31.75 21.59,31.75 20.32,30.48 R14.1 12.19,30.26 v12.19,28.96
BTN1  (via drill 0.51)
  Top 0.254: IC3.123 26.7,30.45 v26.92,30.23 | v12.19,25.65 11.72,26.13 S2.2
  Bottom 0.254: v26.92,30.23 21.84,30.23 20.83,29.21 20.83,27.94 20.32,27.43 R13.1 12.19,26.96 v12.19,25.65
BTN2  (via drill 0.51)
  Top 0.254: IC3.141 22.72,21.45 v22.35,21.08 | S3.2 10.59,19.56 13.46,19.56 13.72,19.3 v13.72,18.8
  Bottom 0.254: v22.35,21.08 20.07,18.8 v13.72,18.8 12.95,18.03 R12.1
CLK_50  (via drill 0.51)
  Top 0.254: IC3.27 39.81,15.56 v40.13,15.24
  Bottom 0.254: v40.13,15.24 40.93,14.44 R6.2
GND  (via drill 0.51)
  Top 0.254: v27.69,21.34 26.97,21.34 26.59,20.95 IC3.142 | IC3.137 26.25,23.45 26.92,24.13 v26.92,25.15 26.62,25.45 IC3.133 23.03,25.45 | v28.19,15.49 28.31,15.61 IC3.4 28.31,20.24 | v27.94,36.07 27.94,37.59 28.81,38.46 IC3.104 | v32.26,36.07 32.26,37.08 33.31,38.14 IC3.95 | v42.93,36.07 44.45,36.07 45.07,35.45 IC3.68 | v37.59,37.34 38.86,37.34 39.31,37.79 IC3.83 | v23.37,29.21 23.63,28.95 IC3.126 | 24.9,28.95 26.33,28.95 | 24.9,29.46 26.33,29.46 | 23.37,29.46 IC3.125 | v42.67,31.75 43.87,32.95 IC3.63 | v23.11,34.04 23.2,33.95 IC3.116 | v42.67,28.19 42.93,27.94 44.97,27.95 IC3.53 | v42.42,24.89 44.86,22.45 IC3.42 | 27.8,15.61 27.8,19.48
  other vias: 40.39,13.46 21.59,7.11 15.75,8.38 17.02,8.38 18.29,8.38 21.59,8.38 21.59,5.84 35.81,9.91 34.04,9.91 22.1,30.99 23.37,30.99 22.1,29.21 39.88,20.07 26.92,28.96 51.82,13.72 35.56,32.26 35.56,25.15 39.12,25.15 39.12,32.26 39.12,28.7 32,32.26 32,28.7 32,25.15 32,30.48 32,26.92 33.78,25.15 37.34,25.15 39.12,26.92 39.12,30.48 37.34,32.26 33.78,32.26 21.84,34.54 20.57,35.81 49.53,13.21 48.01,13.21 47.5,17.53 49.53,19.3 49.53,18.29 49.53,17.27 45.21,18.8 28.19,13.97 12.45,14.48 14.73,14.48 17.02,14.48 19.3,14.48 21.59,14.48 23.88,14.48 26.42,14.48 15.75,12.19 45.72,40.39 47.24,40.39 48.77,40.39 48.26,43.18 52.07,40.89 52.07,43.18 25.65,40.89 23.62,40.89 23.62,42.93 25.65,42.93 18.29,39.37 59.18,49.02 59.18,8.38 6.35,17.27 6.35,23.88 6.35,30.48 33.53,43.43 33.53,40.89 59.18,51.56 61.72,51.56 61.72,49.02 61.72,8.38 59.18,5.84 61.72,5.84 51.82,16 51.82,18.29 52.07,38.61 56.64,46.48 18.29,35.05 13.72,35.05 14.73,17.53 17.02,17.53 19.3,17.53 21.59,17.53
  pour Top (isolate 0.254): 0,57.4 67.06,57.4 67.06,0 0,0
  pour Bottom (isolate 0.254): 0,57.4 67.06,57.4 67.06,0 0,0
IN
  Bottom 0.508: C2.2 L1.2 7.66,43.12 IC2.3
JTAG_EN  (via drill 0.51)
  Top 0.254: IC3.15 33.81,19.78 v33.53,20.07 | R7.1 J1.8
  Bottom 0.254: v33.53,20.07 33.02,19.56 33.02,12.95 32.51,12.45 19.56,12.45 19.05,11.94 19.05,10.16 18.54,9.65 11.43,9.65 10.92,9.14 J1.8
LED0
  Top 0.254: IC3.120 21.13,31.95 19.56,33.53 R15.1
LED1
  Top 0.254: IC3.124 21.36,29.95 19.56,31.75 R16.1
LED2
  Top 0.254: IC3.127 21.08,28.45 19.56,29.97 R17.1
LED3
  Top 0.254: IC3.130 20.8,26.95 19.56,28.19 R18.1
LED4
  Top 0.254: IC3.131 18.87,26.45 R19.1
LED5
  Top 0.254: IC3.132 20.87,25.95 19.56,24.64 R20.1
LED6
  Top 0.254: IC3.135 21.15,24.45 19.56,22.86 R21.1
LED7
  Top 0.254: IC3.140 20.43,21.95 19.56,21.08 R22.1
N$1
  Top 0.254: IC3.6 29.31,13.31 24.89,8.89 24.89,7.11 J2.1
N$2
  Top 0.254: IC3.7 29.81,12.54 26.16,8.89 J3.1
N$3
  Top 0.254: IC3.8 30.31,11.77 27.43,8.89 27.43,7.11 J4.1
N$4
  Top 0.254: IC3.10 31.31,11.5 28.7,8.89 J5.1
N$5
  Top 0.254: IC3.11 31.81,10.98 29.97,9.14 29.97,7.11 J6.1
N$6
  Top 0.254: IC3.12 32.31,9.45 J7.1
N$7
  Top 0.254: IC3.14 33.31,8.85 J9.1
N$8
  Top 0.254: IC3.17 34.81,9.13 35.05,8.89 35.05,7.11 J10.1
N$9
  Top 0.254: IC3.21 36.81,8.87 J11.1
N$10
  Top 0.254: IC3.22 37.31,9.68 37.59,9.4 37.59,7.11 J12.1
N$11
  Top 0.254: IC3.24 38.31,9.7 38.86,9.14 J13.1
N$12
  Top 0.254: IC3.25 38.81,10.21 40.13,8.89 40.13,7.11 J14.1
N$13
  Top 0.254: IC3.13 32.81,9.19 32.51,8.89 32.51,7.11 J8.1
N$14
  Top 0.254: IC3.110 23.75,36.95 22.35,38.35 22.35,45.72 19.81,48.26 19.81,50.29 J73.1
N$15
  Top 0.254: IC3.111 23.49,36.45 21.84,38.1 21.84,45.21 18.54,48.51 J74.1
N$16
  Top 0.254: IC3.112 23.23,35.95 21.34,37.85 21.34,44.7 17.27,48.77 17.27,50.29 J75.1
N$17
  Top 0.254: IC3.113 22.97,35.45 20.83,37.59 20.83,44.2 J76.1
N$18
  Top 0.254: IC3.114 22.71,34.95 20.32,37.34 20.32,43.94 16.51,47.75 15.49,47.75 14.73,48.51 14.73,50.29 J77.1
N$19
  Top 0.254: IC3.118 22.17,32.95 19.81,35.31 19.81,43.69 16.26,47.24 15.24,47.24 J78.1
N$20
  Top 0.254: IC3.119 21.9,32.45 19.3,35.05 19.3,43.43 16,46.74 13.72,46.74 12.19,48.26 12.19,50.29 J79.1
N$21
  Top 0.254: IC3.88 36.81,46.97 J58.1
N$22
  Top 0.254: IC3.89 36.31,47.23 37.59,48.51 37.59,50.29 J59.1
N$23
  Top 0.254: IC3.90 35.81,48.51 J60.1
N$24
  Top 0.254: IC3.91 35.31,48.26 35.05,48.51 35.05,50.29 J61.1
N$25
  Top 0.254: IC3.92 34.81,47.99 J62.1
N$26
  Top 0.254: IC3.93 34.31,46.72 32.51,48.51 32.51,50.29 J63.1
N$27
  Top 0.254: IC3.96 32.81,47.45 J64.1
N$28
  Top 0.254: IC3.97 32.31,45.92 29.97,48.26 29.97,50.29 J65.1
N$29
  Top 0.254: IC3.98 31.81,45.66 28.7,48.77 J66.1
N$30
  Top 0.254: IC3.99 31.31,44.38 27.43,48.26 27.43,50.29 J67.1
N$31
  Top 0.254: IC3.100 30.81,43.87 26.67,48.01 26.67,48.51 J68.1
N$32
  Top 0.254: IC3.101 30.31,42.84 24.89,48.26 24.89,50.29 J69.1
N$33
  Top 0.254: IC3.102 29.81,42.33 23.88,48.26 23.88,48.77 J70.1
N$34
  Top 0.254: IC3.105 28.31,42.56 22.35,48.51 22.35,50.29 J71.1
N$35
  Top 0.254: IC3.106 27.81,42.29 J72.1
N$46
  Top 0.254: IC3.26 39.31,10.47 J15.1
N$48
  Top 0.254: IC3.28 40.31,16.33 42.67,13.97 42.67,7.11 J16.1
N$49
  Top 0.254: IC3.29 40.81,16.59 43.94,13.46 J17.1
N$50
  Top 0.254: IC3.30 41.31,16.86 45.21,12.95 45.21,7.11 J18.1
N$51
  Top 0.254: IC3.32 42.31,16.62 46.48,12.45 J19.1
N$52
  Top 0.254: J20.1 60.45,12.19 47.5,12.19 42.81,16.88 IC3.33
N$53
  Top 0.254: IC3.38 51.68,20.45 58.67,13.46 J21.1
N$54
  Top 0.254: IC3.39 52.2,20.95 58.42,14.73 60.45,14.73 J22.1
N$55
  Top 0.254: IC3.41 52.47,21.95 58.42,16 J23.1
N$56
  Top 0.254: IC3.44 54.02,23.45 58.93,18.54 J25.1
N$57
  Top 0.254: IC3.45 54.53,23.95 58.67,19.81 60.45,19.81 J26.1
N$58
  Top 0.254: IC3.46 55.3,24.45 58.67,21.08 J27.1
N$59
  Top 0.254: IC3.47 55.82,24.95 58.42,22.35 60.45,22.35 J28.1
N$60
  Top 0.254: IC3.50 56.86,26.45 58.42,24.89 60.45,24.89 J29.1
N$61
  Top 0.254: IC3.48 56.59,25.45 58.42,23.62 J30.1
N$62
  Top 0.254: IC3.52 57.13,27.45 58.42,26.16 J31.1
N$63
  Top 0.254: IC3.54 57.4,28.45 58.42,27.43 60.45,27.43 J32.1
N$64
  Top 0.254: IC3.55 58.93,28.95 J33.1
N$65
  Top 0.254: IC3.56 57.92,29.45 58.42,29.97 60.45,29.97 J34.1
N$66
  Top 0.254: IC3.57 57.38,29.95 58.67,31.24 J35.1
N$67
  Top 0.254: IC3.58 56.36,30.45 58.42,32.51 60.45,32.51 J36.1
N$68
  Top 0.254: IC3.59 55.59,30.95 58.42,33.78 J37.1
N$69
  Top 0.254: IC3.60 54.82,31.45 58.42,35.05 60.45,35.05 J38.1
N$70
  Top 0.254: IC3.61 53.8,31.95 58.17,36.32 J39.1
N$71
  Top 0.254: IC3.62 53.28,32.45 58.42,37.59 60.45,37.59 J40.1
N$72
  Top 0.254: IC3.64 52.5,33.45 57.91,38.86 J41.1
N$73
  Top 0.254: IC3.65 52.24,33.95 58.42,40.13 60.45,40.13 J42.1
N$74
  Top 0.254: IC3.66 51.72,34.45 58.67,41.4 J43.1
N$75
  Top 0.254: IC3.69 51.95,35.95 58.67,42.67 60.45,42.67 J44.1
N$76
  Top 0.254: IC3.70 51.69,36.45 J45.1
N$77
  Top 0.254: IC3.75 43.31,41.28 47.5,45.47 49.78,45.47 52.83,48.51 52.83,50.29 J46.1
N$78
  Top 0.254: IC3.74 43.81,41.02 47.75,44.96 50.04,44.96 J47.1
N$79
  Top 0.254: IC3.76 42.81,41.54 47.24,45.97 48.51,45.97 J49.1
N$80
  Top 0.254: IC3.79 41.31,42.33 46.48,47.5 47.24,47.5 47.75,48.01 47.75,50.29 J50.1
N$81
  Top 0.254: IC3.81 40.31,43.61 45.21,48.51 45.21,50.29 J52.1
N$82
  Top 0.254: IC3.80 40.81,42.59 46.48,48.26 J53.1
N$83
  Top 0.254: IC3.84 38.81,43.89 J55.1
N$84
  Top 0.254: IC3.87 37.31,45.69 40.13,48.51 40.13,50.29 J56.1
N$85
  Top 0.254: IC3.86 37.81,45.43 J57.1
N$86
  Top 0.254: IC3.85 38.31,44.91 41.15,47.75 41.91,47.75 42.67,48.51 42.67,50.29 J54.1
N$87
  Top 0.254: IC3.78 41.81,42.06 46.74,46.99 47.75,46.99 49.02,48.26 J51.1
N$88
  Top 0.254: IC3.77 42.31,41.8 46.99,46.48 48.26,46.48 50.29,48.51 50.29,50.29 J48.1
N$89
  Top 0.254: IC3.43 52.49,22.95 58.42,17.27 60.45,17.27 J24.1
N$90
  Bottom 0.254: R6.1 44.06,16.04 IC1.3
N$91
  Top 0.254: X1.2 8.12,40.89 10.67,40.89 10.88,40.68 R5.2
N$92
  Top 0.254: X1.3 10.16,40.13 10.41,39.88 10.41,39.37 10.71,39.08 R5.1
N$93
  Bottom 0.254: R2.1 46.26,12.37 IC1.1
N$94
  Top 0.254: LED1.1 R8.2
N$97  (via drill 0.51)
  Top 0.254: IC3.129 23.09,27.45 v22.86,27.69
  Bottom 0.254: v22.86,27.69 22.61,27.43 22.61,25.65 22.1,25.15 13.72,25.15 12.7,24.13 R9.1
N$99  (via drill 0.51)
  Top 0.254: IC3.136 22.17,23.95 v21.84,23.62
  Bottom 0.254: v21.84,23.62 20.32,22.1 R10.1
N$100  (via drill 0.51)
  Top 0.254: IC3.138 22.95,22.95 v22.86,22.86
  Bottom 0.254: v22.86,22.86 20.07,20.07 R11.1
N$101
  Top 0.254: LED6.1 R19.2
N$102
  Top 0.254: LED7.1 R20.2
N$103
  Top 0.254: LED8.1 R21.2
N$104
  Top 0.254: LED9.1 R22.2
N$105
  Top 0.254: LED2.1 R15.2
N$106
  Top 0.254: LED3.1 R16.2
N$107
  Top 0.254: LED4.1 R17.2
N$108
  Top 0.254: LED5.1 R18.2
OUT
  Bottom 0.508: IC2.2 IC2.4 14.73,39.93 JP1.1 13.14,36.58 C3.2 12.13,33.68 C4.2
TCK  (via drill 0.51)
  Top 0.254: IC3.18 35.31,19.81 v35.05,20.07 | R4.2 4.1,11.14 4.57,10.67 4.57,6.35 4.06,5.84 J1.1
  Bottom 0.254: v35.05,20.07 35.05,20.57 34.54,21.08 32.77,21.08 32.26,20.57 32.26,13.46 31.75,12.95 19.05,12.95 18.54,12.45 18.54,10.67 18.03,10.16 7.62,10.16 7.11,9.65 7.11,7.62 6.6,7.11 4.06,7.11 3.3,6.35 J1.1
TDI  (via drill 0.51)
  Top 0.254: IC3.19 v35.81,16.26 | R3.1 13.46,9.91 13.21,9.65 12.45,9.65 12.19,9.4 12.19,6.35 12.7,5.84 J1.9
  Bottom 0.254: v35.81,16.26 35.81,11.94 35.31,11.43 20.57,11.43 20.07,10.92 20.07,6.35 19.56,5.84 J1.9
TDO  (via drill 0.51)
  Top 0.254: IC3.20 36.31,19.8 v36.58,20.07
  Bottom 0.254: v36.58,20.07 36.83,19.81 36.83,11.43 36.32,10.92 21.08,10.92 20.57,10.41 20.57,5.08 20.07,4.57 6.35,4.57 5.84,5.08 J1.3
TMS  (via drill 0.51)
  Top 0.254: IC3.16 34.31,16.53 v34.04,16.26 | R1.1 8.38,9.91 8.64,9.65 9.4,9.65 9.65,9.4 9.65,6.6 8.89,5.84 J1.5
  Bottom 0.254: v34.04,16.26 34.04,12.45 33.53,11.94 20.07,11.94 19.56,11.43 19.56,7.62 19.05,7.11 8.89,7.11 8.38,6.6 J1.5
V_USB
  Top 0.508: X1.1 8.26,41.91 10.67,41.91 11.18,42.42 11.18,45.47 9.91,46.74 6.6,46.74 5.84,47.5 J95.1 J94.1
  Bottom 0.508: L1.1 6.1,45.25 6.1,46.48 5.84,46.74 J95.1 J94.1

### Text on the board
tValues: JTAG
bValues: AT 5/25/2017